# EAGLE design MCP23017_I_v1_0 (EAGLE 9.6.2)
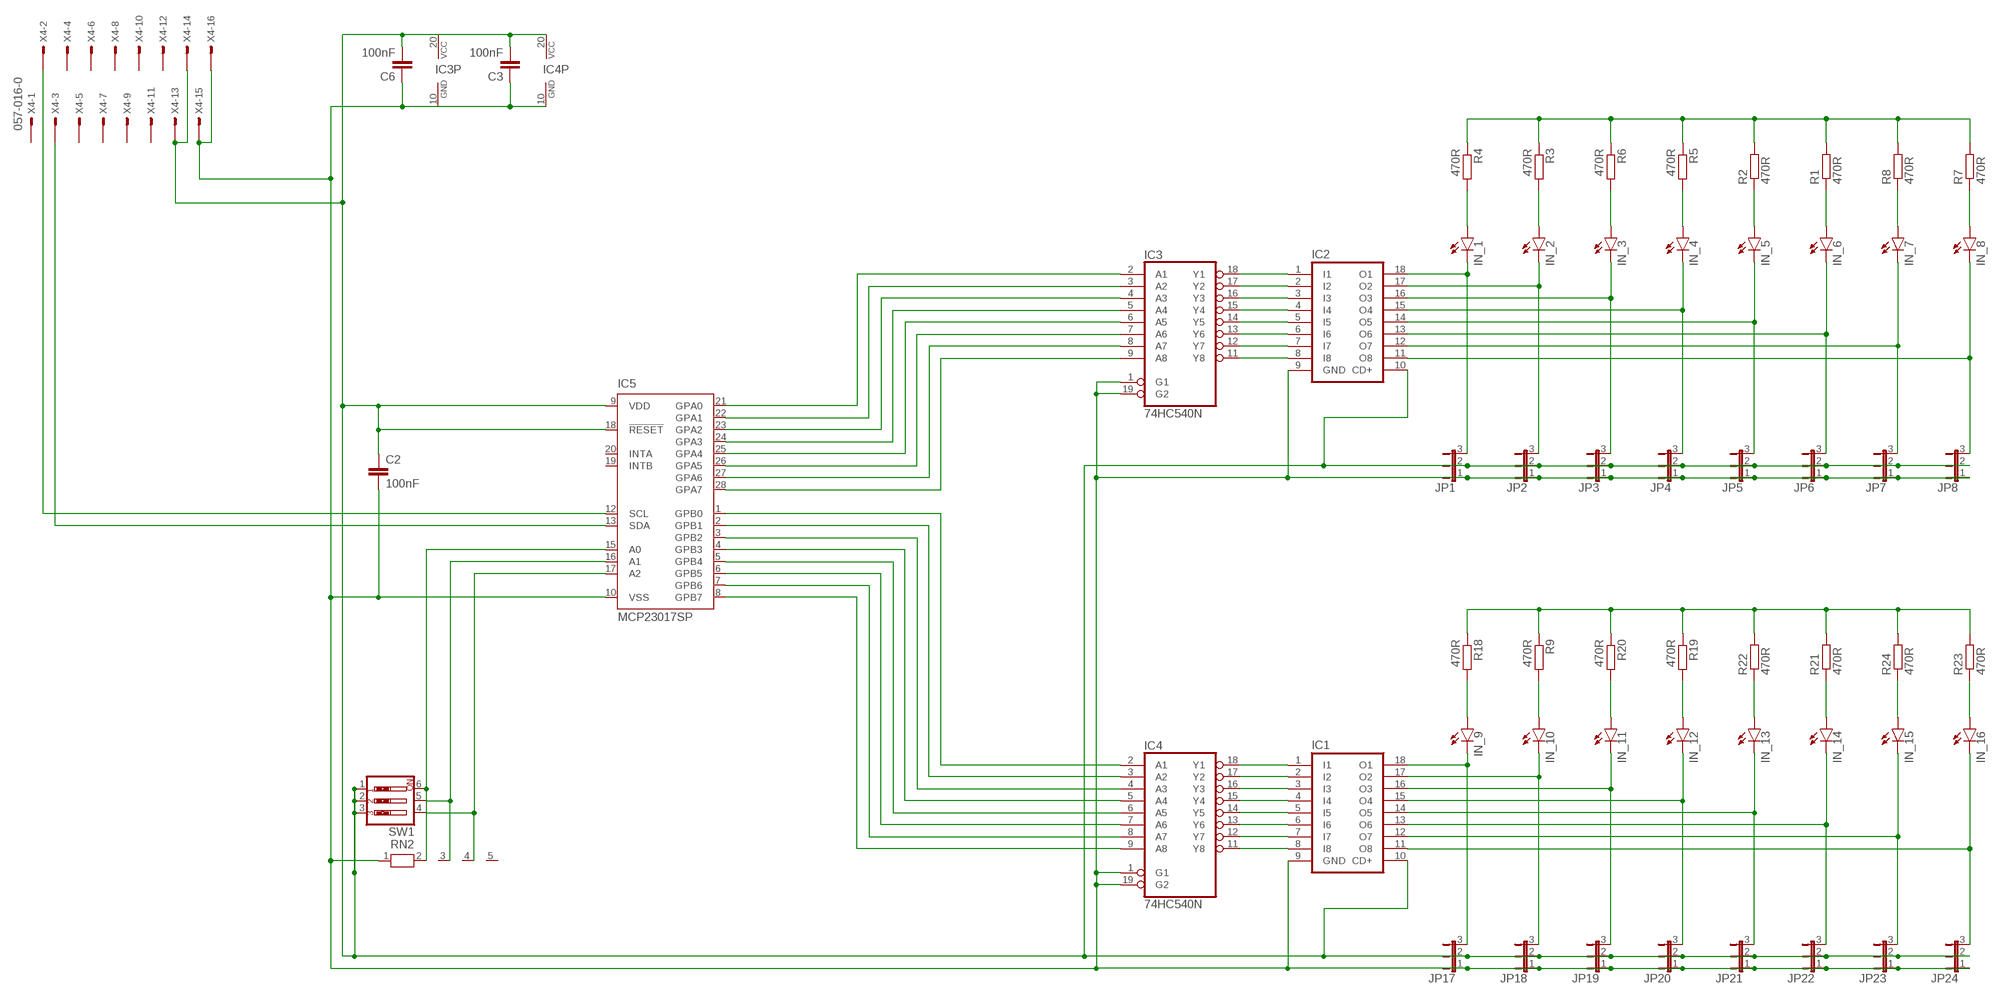
[diagram p0: schematic, sheet 1]

## Parts
C2  100nF  C-EU025-024X044  [C025-024X044]
C3  100nF  C-EU025-024X044  [C025-024X044]
C6  100nF  C-EU025-024X044  [C025-024X044]
IC1  ULN2803A  [DIL18]
IC2  ULN2803A  [DIL18]
IC3  74HC540N  [DIL20]
IC4  74HC540N  [DIL20]
IC5  MCP23017SP  [DIL28-3]
IN_1  LED3MM  [LED3MM]
IN_2  LED3MM  [LED3MM]
IN_3  LED3MM  [LED3MM]
IN_4  LED3MM  [LED3MM]
IN_5  LED3MM  [LED3MM]
IN_6  LED3MM  [LED3MM]
IN_7  LED3MM  [LED3MM]
IN_8  LED3MM  [LED3MM]
IN_9  LED3MM  [LED3MM]
IN_10  LED3MM  [LED3MM]
IN_11  LED3MM  [LED3MM]
IN_12  LED3MM  [LED3MM]
IN_13  LED3MM  [LED3MM]
IN_14  LED3MM  [LED3MM]
IN_15  LED3MM  [LED3MM]
IN_16  LED3MM  [LED3MM]
JP1  JP2E  [JP2]
JP2  JP2E  [JP2]
JP3  JP2E  [JP2]
JP4  JP2E  [JP2]
JP5  JP2E  [JP2]
JP6  JP2E  [JP2]
JP7  JP2E  [JP2]
JP8  JP2E  [JP2]
JP17  JP2E  [JP2]
JP18  JP2E  [JP2]
JP19  JP2E  [JP2]
JP20  JP2E  [JP2]
JP21  JP2E  [JP2]
JP22  JP2E  [JP2]
JP23  JP2E  [JP2]
JP24  JP2E  [JP2]
R1  470R  R-EU_0309/10  [0309/10]
R2  470R  R-EU_0309/10  [0309/10]
R3  470R  R-EU_0309/10  [0309/10]
R4  470R  R-EU_0309/10  [0309/10]
R5  470R  R-EU_0309/10  [0309/10]
R6  470R  R-EU_0309/10  [0309/10]
R7  470R  R-EU_0309/10  [0309/10]
R8  470R  R-EU_0309/10  [0309/10]
R9  470R  R-EU_0309/10  [0309/10]
R18  470R  R-EU_0309/10  [0309/10]
R19  470R  R-EU_0309/10  [0309/10]
R20  470R  R-EU_0309/10  [0309/10]
R21  470R  R-EU_0309/10  [0309/10]
R22  470R  R-EU_0309/10  [0309/10]
R23  470R  R-EU_0309/10  [0309/10]
R24  470R  R-EU_0309/10  [0309/10]
RN2  RN04  [RN-5]
SW1  SW_DIP-3  [EDG-03]
X4  057-016-0  [057-016-0]

## Nets
GND1: C2.2 C3.1 C6.1 IC1.9(GND) IC2.9(GND) IC3.1(G1) IC3.10(GND) IC3.19(G2) IC4.1(G1) IC4.10(GND) IC4.19(G2) IC5.10(VSS) JP1.1 JP2.1 JP3.1 JP4.1 JP5.1 JP6.1 JP7.1 JP8.1 JP17.1 JP18.1 JP19.1 JP20.1 JP21.1 JP22.1 JP23.1 JP24.1 RN2.1 X4.15 X4.16
N$1: IC2.18(O1) IN_1.K(C) JP1.3
N$2: IC2.17(O2) IN_2.K(C) JP2.3
N$3: IC2.16(O3) IN_3.K(C) JP3.3
N$4: IC2.15(O4) IN_4.K(C) JP4.3
N$5: IC2.14(O5) IN_5.K(C) JP5.3
N$6: IC5.17(A2) RN2.4 SW1.4
N$7: IC2.13(O6) IN_6.K(C) JP6.3
N$8: IC2.12(O7) IN_7.K(C) JP7.3
N$9: IC2.11(O8) IN_8.K(C) JP8.3
N$10: IN_8.A R7.1
N$11: IN_7.A R8.1
N$12: IC2.8(I8) IC3.11(Y8)
N$13: IN_6.A R1.1
N$14: IC2.7(I7) IC3.12(Y7)
N$15: IC2.6(I6) IC3.13(Y6)
N$16: IC2.5(I5) IC3.14(Y5)
N$17: IC2.4(I4) IC3.15(Y4)
N$18: IC2.3(I3) IC3.16(Y3)
N$19: IC2.2(I2) IC3.17(Y2)
N$20: IC2.1(I1) IC3.18(Y1)
N$21: IC3.2(A1) IC5.21(GPA0)
N$22: IC3.3(A2) IC5.22(GPA1)
N$23: IC3.4(A3) IC5.23(GPA2)
N$24: IC3.5(A4) IC5.24(GPA3)
N$25: IC3.6(A5) IC5.25(GPA4)
N$26: IC3.7(A6) IC5.26(GPA5)
N$27: IC3.8(A7) IC5.27(GPA6)
N$28: IC3.9(A8) IC5.28(GPA7)
N$29: IN_5.A R2.1
N$30: IN_4.A R5.2
N$31: IN_3.A R6.2
N$32: IN_2.A R3.2
N$33: IN_1.A R4.2
N$34: IC1.8(I8) IC4.11(Y8)
N$35: IC5.16(A1) RN2.3 SW1.5
N$36: IC1.18(O1) IN_9.K(C) JP17.3
N$37: IC1.17(O2) IN_10.K(C) JP18.3
N$38: IC1.16(O3) IN_11.K(C) JP19.3
N$39: IC1.7(I7) IC4.12(Y7)
N$40: IC1.6(I6) IC4.13(Y6)
N$41: IC1.15(O4) IN_12.K(C) JP20.3
N$42: IC1.14(O5) IN_13.K(C) JP21.3
N$43: IC1.13(O6) IN_14.K(C) JP22.3
N$44: IC1.5(I5) IC4.14(Y5)
N$45: IC1.4(I4) IC4.15(Y4)
N$46: IC1.3(I3) IC4.16(Y3)
N$47: IC1.2(I2) IC4.17(Y2)
N$48: IC1.1(I1) IC4.18(Y1)
N$49: IC4.2(A1) IC5.1(GPB0)
N$50: IC4.3(A2) IC5.2(GPB1)
N$51: IC4.4(A3) IC5.3(GPB2)
N$52: IC4.5(A4) IC5.4(GPB3)
N$53: IC1.12(O7) IN_15.K(C) JP23.3
N$54: IC1.11(O8) IN_16.K(C) JP24.3
N$55: IC4.6(A5) IC5.5(GPB4)
N$56: IC4.7(A6) IC5.6(GPB5)
N$57: IC4.8(A7) IC5.7(GPB6)
N$58: IC4.9(A8) IC5.8(GPB7)
N$59: IN_16.A R23.1
N$60: IN_15.A R24.1
N$61: IN_14.A R21.1
N$62: IN_13.A R22.1
N$63: IN_12.A R19.2
N$64: IN_11.A R20.2
N$65: IN_10.A R9.2
N$66: IN_9.A R18.2
N$82: IC5.12(SCL) X4.2
N$84: IC5.13(SDA) X4.3
N$85: IC5.15(A0) RN2.2 SW1.6
VCC5.2: C2.1 C3.2 C6.2 IC1.10(CD+) IC2.10(CD+) IC3.20(VCC) IC4.20(VCC) IC5.9(VDD) IC5.18(!RESET) JP1.2 JP2.2 JP3.2 JP4.2 JP5.2 JP6.2 JP7.2 JP8.2 JP17.2 JP18.2 JP19.2 JP20.2 JP21.2 JP22.2 JP23.2 JP24.2 R1.2 R2.2 R3.1 R4.1 R5.1 R6.1 R7.2 R8.2 R9.1 R18.1 R19.1 R20.1 R21.2 R22.2 R23.2 R24.2 SW1.1 SW1.2 SW1.3 X4.13 X4.14
Unconnected: IC5.19(INTB) IC5.20(INTA) RN2.5 X4.1 X4.4 X4.5 X4.6 X4.7 X4.8 X4.9 X4.10 X4.11 X4.12

## Library data of the parts
C2 C3 C6 = resistor:C-EU: CAPACITOR, European symbol
IC1 IC2 = uln-udn:ULN2803A: DRIVER ARRAY
IC3 IC4 = 74xx-eu:74*540: Inverting Octal BUFFER and LINE DRIVER, 3-state
IC5 = microchip-6:MCP23017: http://ww1.microchip.com/downloads/en/DeviceDoc/21952a.pdf Source: http://ww1.microchip.com/downloads/en/DeviceDoc/21952a.pdf
IN_1-IN_16 = led:LED: LED OSRAM: - CHIPLED LG R971, LG N971, LY N971, LG Q971, LY Q971, LO R971, LY R971 LH N974, LH R974 LS Q976, LO Q976, LY Q976 LO Q996 - Hyper CHIPLED LW Q18S LB Q993, LB Q99A, LB R99A - SideLED LS A670, LO A670, LY A670, LG A670, LP A670 LB A673, LV A673, LT A673, LW A673 LH A674 LY A675 LS A676, LA A676, LO A676, LY A676, LW A676 LS A679, LY A679, LG A679 - Hyper Micro SIDELED® LS Y876, LA Y876, LO Y876, LY Y876 LT Y87S - SmartLED LW L88C, LW L88S LB L89C, LB L89S, LG L890 LS L89K, LO L89K, LY L89K LS L896, LA L896, LO L896, LY L896 - TOPLED LS T670, LO T670, LY T670, LG T670, LP T670 LSG T670, LSP T670, LSY T670, LOP T670, LYG T670 LG T671, LOG T671, LSG T671 LB T673, LV T673, LT T673, LW T673 LH T674 LS T676, LA T676, LO T676, LY T676, LB T676, LH T676, LSB T676, LW T676 LB T67C, LV T67C, LT T67C, LS T67K, LO T67K, LY T67K, LW E67C LS E67B, LA E67B, LO E67B, LY E67B, LB E67C, LV E67C, LT E67C LW T67C LS T679, LY T679, LG T679 LS T770, LO T770, LY T770, LG T770, LP T770 LB T773, LV T773, LT T773, LW T773 LH T774 LS E675, LA E675, LY E675, LS T675 LS T776, LA T776, LO T776, LY T776, LB T776 LHGB T686 LT T68C, LB T68C - Hyper Mini TOPLED® LB M676 - Mini TOPLED Santana® LG M470 LS M47K, LO M47K, LY M47K Source: http://www.osram.convergy.de LUXEON: - LUMILED® LXK2-PW12-R00, LXK2-PW12-S00, LXK2-PW14-U00, LXK2-PW14-V00 LXK2-PM12-R00, LXK2-PM12-S00, LXK2-PM14-U00 LXK2-PE12-Q00, LXK2-PE12-R00, LXK2-PE12-S00, LXK2-PE14-T00, LXK2-PE14-U00 LXK2-PB12-K00, LXK2-PB12-L00, LXK2-PB12-M00, LXK2-PB14-N00, LXK2-PB14-P00, LXK2-PB14-Q00 LXK2-PR12-L00, LXK2-PR12-M00, LXK2-PR14-Q00, LXK2-PR14-R00 LXK2-PD12-Q00, LXK2-PD12-R00, LXK2-PD12-S00 LXK2-PH12-R00, LXK2-PH12-S00 LXK2-PL12-P00, LXK2-PL12-Q00, LXK2-PL12-R00 Source: www.luxeon.com KINGBRIGHT: KA-3528ASYC Source: www.kingbright.com
JP1-JP8 JP17-JP24 = jumper:JP2E: JUMPER
R1-R9 R18-R24 = resistor:R-EU_: RESISTOR, European symbol
RN2 = resistor-net:RN04: RESISTOR NETWORK; OC_FARNELL: unknown; OC_NEWARK: unknown
SW1 = special:SW_DIP-3: DIP SWITCH
X4 = con-panduit:057-016-: CONNECTOR 10-pin series 057 contact pc board low profile headers; OC_FARNELL: unknown; OC_NEWARK: unknown

## Board
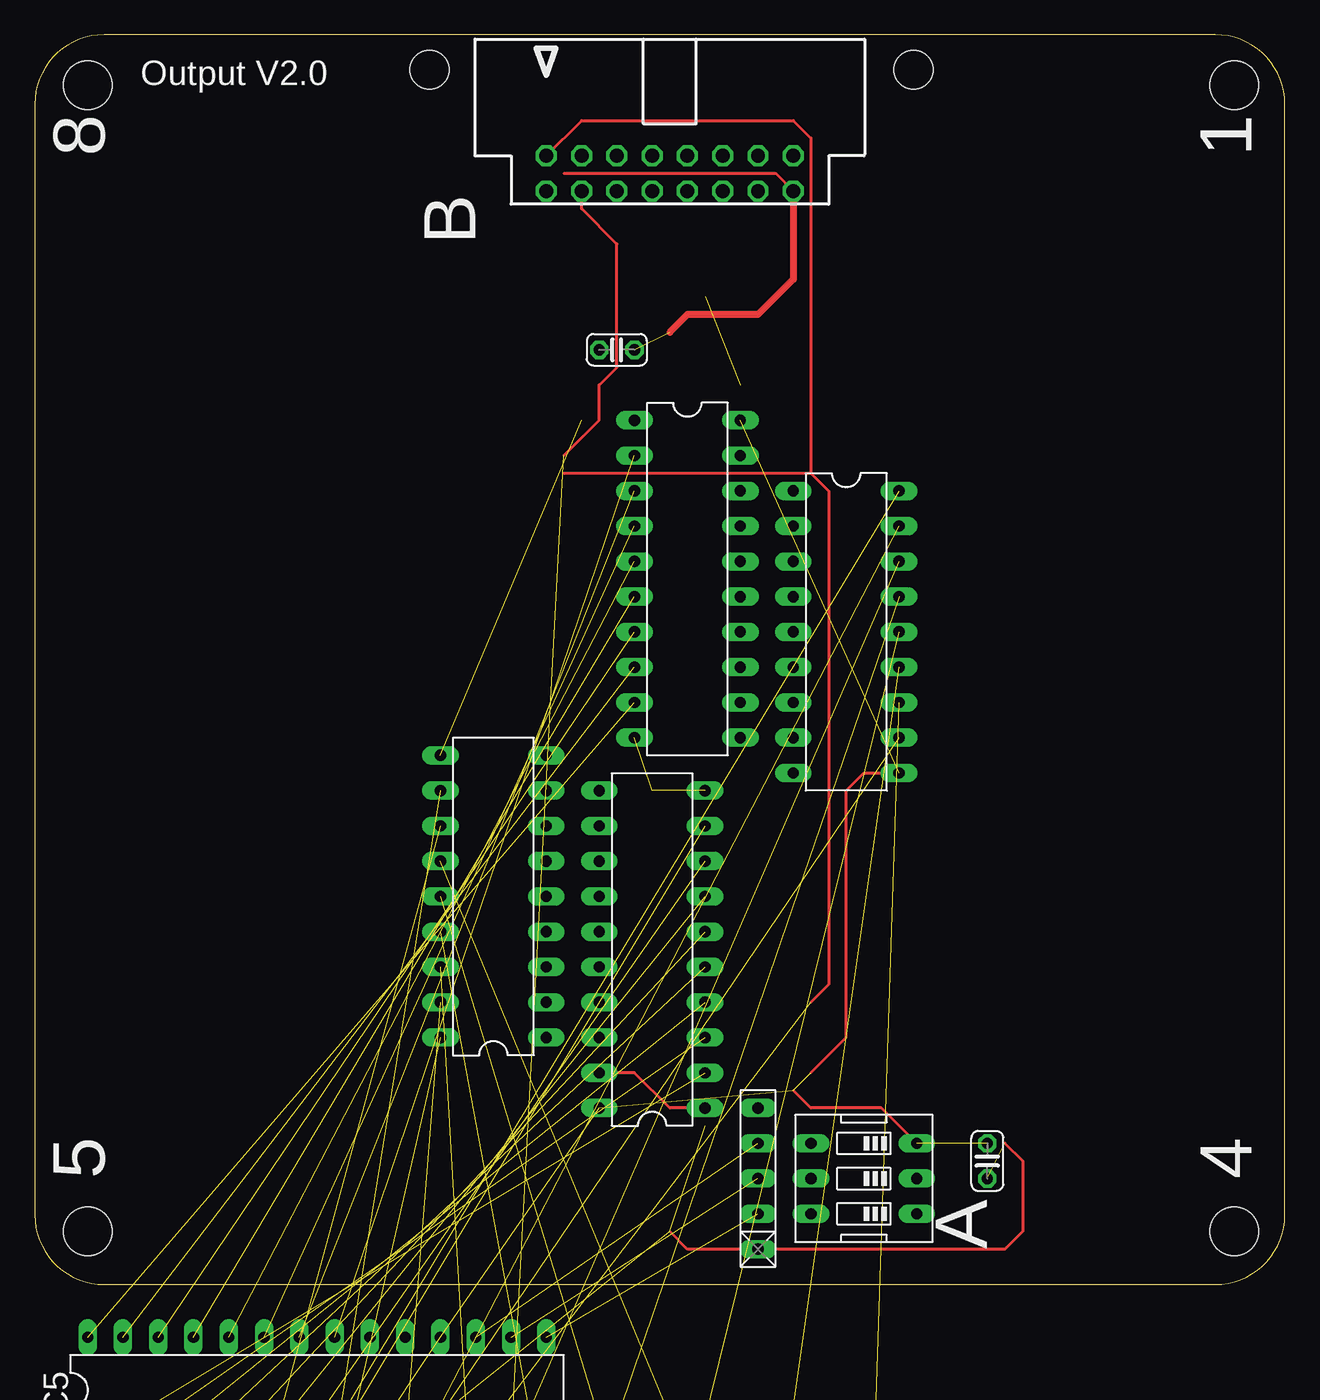
[diagram p1: board, top side]
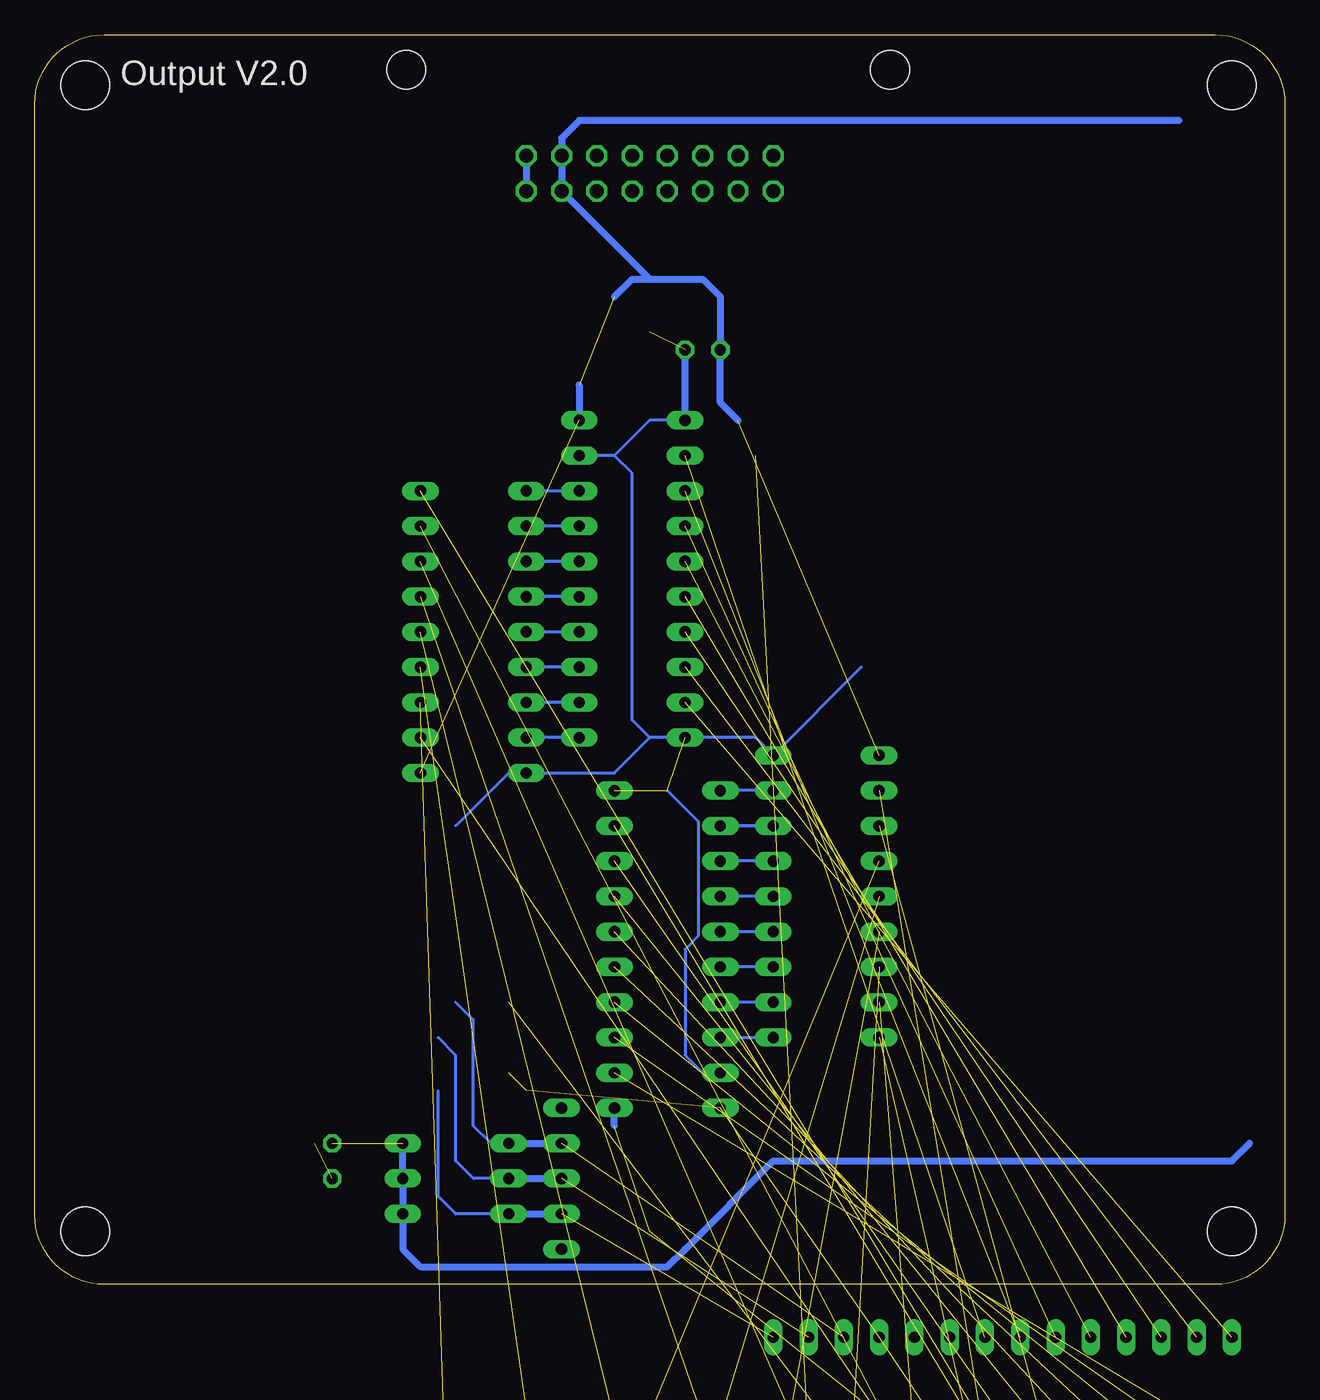
[diagram p2: board, bottom side, seen from below]

Size 90 x 90 mm. Coordinates in mm from the lower left corner, seen from the top.
Outline: 0,85 0,5 arc90 5,0 85,0 arc90 90,5 90,85 arc90 85,90 5,90 arc90 0,85
Copper layers (1*16): Top 0.035mm / dielectric 1.5mm / Bottom 0.035mm
Design rules "default": minimum track width 6mil, minimum drill 0.35mm, track to track 6mil, track to pad 6mil, pad to pad 6mil, via to via 6mil, smd to smd 6mil, copper to edge 40mil, drill to drill 6mil, minimum pad ring 10mil, minimum via ring 8mil, stop-mask expansion 4mil, vias tented up to drill 0mil, thermal gap 10mil
Holes 3.5 mm at 86.36,86.36 3.81,86.36 3.81,3.81 86.36,3.81

### Footprints (pad centres in the part's own frame; a part is rotated, then mirrored left to right if it is on the bottom)
C025-024X044 = drill 0.813 octagon: 1 -1.27,0; 2 1.27,0
DIL18 = drill 0.813 long: 1 -10.16,-3.81; 2 -7.62,-3.81; 3 -5.08,-3.81; 4 -2.54,-3.81; 5 0,-3.81; 6 2.54,-3.81; 7 5.08,-3.81; 8 7.62,-3.81; 9 10.16,-3.81; 10 10.16,3.81; 11 7.62,3.81; 12 5.08,3.81; 13 2.54,3.81; 14 0,3.81; 15 -2.54,3.81; 16 -5.08,3.81; 17 -7.62,3.81; 18 -10.16,3.81
DIL20 = drill 0.813 long: 1 -11.43,-3.81; 2 -8.89,-3.81; 3 -6.35,-3.81; 4 -3.81,-3.81; 5 -1.27,-3.81; 6 1.27,-3.81; 7 3.81,-3.81; 8 6.35,-3.81; 9 8.89,-3.81; 10 11.43,-3.81; 11 11.43,3.81; 12 8.89,3.81; 13 6.35,3.81; 14 3.81,3.81; 15 1.27,3.81; 16 -1.27,3.81; 17 -3.81,3.81; 18 -6.35,3.81; 19 -8.89,3.81; 20 -11.43,3.81
DIL28-3 = drill 0.813 long: 1 -16.51,-3.81; 2 -13.97,-3.81; 3 -11.43,-3.81; 4 -8.89,-3.81; 5 -6.35,-3.81; 6 -3.81,-3.81; 7 -1.27,-3.81; 8 1.27,-3.81; 9 3.81,-3.81; 10 6.35,-3.81; 11 8.89,-3.81; 12 11.43,-3.81; 13 13.97,-3.81; 14 16.51,-3.81; 15 16.51,3.81; 16 13.97,3.81; 17 11.43,3.81; 18 8.89,3.81; 19 6.35,3.81; 20 3.81,3.81; 21 1.27,3.81; 22 -1.27,3.81; 23 -3.81,3.81; 24 -6.35,3.81; 25 -8.89,3.81; 26 -11.43,3.81; 27 -13.97,3.81; 28 -16.51,3.81
LED3MM = drill 0.813 octagon: A -1.27,0; K 1.27,0
JP2 = drill 0.914 long: 1 -2.54,0; 2 0,0; 3 2.54,0
0309/10 = drill 0.813 octagon: 1 -5.08,0; 2 5.08,0
RN-5 = drill 0.813 long: 1 -5.08,0; 2 -2.54,0; 3 0,0; 4 2.54,0; 5 5.08,0
EDG-03 = drill 0.813 long: 1 -2.54,-3.81; 2 0,-3.81; 3 2.54,-3.81; 4 2.54,3.81; 5 0,3.81; 6 -2.54,3.81
057-016-0 = drill 1 octagon: 1 -8.89,-5.08; 2 -8.89,-2.54; 3 -6.35,-5.08; 4 -6.35,-2.54; 5 -3.81,-5.08; 6 -3.81,-2.54; 7 -1.27,-5.08; 8 -1.27,-2.54; 9 1.27,-5.08; 10 1.27,-2.54; 11 3.81,-5.08; 12 3.81,-2.54; 13 6.35,-5.08; 14 6.35,-2.54; 15 8.89,-5.08; 16 8.89,-2.54 | hole 2.8: -17.29,3.66; 17.54,3.66

### Placement (x,y rotation side)
C2  68.58,8.89 270 top
C3  2.54,-27.94 0 top  (outside the outline)
C6  41.91,67.31 180 top
IC1  33.02,27.94 90 top
IC2  58.42,46.99 270 top
IC3  46.99,50.8 270 top
IC4  44.45,24.13 90 top
IC5  20.32,-7.62 0 top  (outside the outline)
IN_1  33.02,-106.68 0 top  (outside the outline)
IN_2  41.91,-106.68 0 top  (outside the outline)
IN_3  50.8,-106.68 0 top  (outside the outline)
IN_4  2.54,-111.76 0 top  (outside the outline)
IN_5  11.43,-111.76 0 top  (outside the outline)
IN_6  20.32,-111.76 0 top  (outside the outline)
IN_7  29.21,-111.76 0 top  (outside the outline)
IN_8  38.1,-111.76 0 top  (outside the outline)
IN_9  46.99,-111.76 0 top  (outside the outline)
IN_10  15.24,-100.33 0 top  (outside the outline)
IN_11  22.86,-106.68 0 top  (outside the outline)
IN_12  25.4,-100.33 0 top  (outside the outline)
IN_13  35.56,-100.33 0 top  (outside the outline)
IN_14  45.72,-100.33 0 top  (outside the outline)
IN_15  2.54,-106.68 0 top  (outside the outline)
IN_16  12.7,-106.68 0 top  (outside the outline)
JP1  3.81,-35.56 0 top  (outside the outline)
JP2  12.7,-35.56 0 top  (outside the outline)
JP3  21.59,-35.56 0 top  (outside the outline)
JP4  30.48,-35.56 0 top  (outside the outline)
JP5  39.37,-35.56 0 top  (outside the outline)
JP6  48.26,-35.56 0 top  (outside the outline)
JP7  57.15,-35.56 0 top  (outside the outline)
JP8  3.81,-43.18 0 top  (outside the outline)
JP17  12.7,-43.18 0 top  (outside the outline)
JP18  21.59,-43.18 0 top  (outside the outline)
JP19  30.48,-43.18 0 top  (outside the outline)
JP20  39.37,-43.18 0 top  (outside the outline)
JP21  48.26,-43.18 0 top  (outside the outline)
JP22  57.15,-43.18 0 top  (outside the outline)
JP23  3.81,-50.8 0 top  (outside the outline)
JP24  12.7,-50.8 0 top  (outside the outline)
R1  22.86,-50.8 0 top  (outside the outline)
R2  35.56,-50.8 0 top  (outside the outline)
R3  48.26,-50.8 0 top  (outside the outline)
R4  6.35,-58.42 0 top  (outside the outline)
R5  19.05,-58.42 0 top  (outside the outline)
R6  31.75,-58.42 0 top  (outside the outline)
R7  44.45,-58.42 0 top  (outside the outline)
R8  6.35,-64.77 0 top  (outside the outline)
R9  19.05,-64.77 0 top  (outside the outline)
R18  31.75,-77.47 0 top  (outside the outline)
R19  44.45,-77.47 0 top  (outside the outline)
R20  6.35,-83.82 0 top  (outside the outline)
R21  19.05,-83.82 0 top  (outside the outline)
R22  31.75,-83.82 0 top  (outside the outline)
R23  44.45,-83.82 0 top  (outside the outline)
R24  6.35,-90.17 0 top  (outside the outline)
RN2  52.07,7.62 90 top
SW1  59.69,7.62 90 top
X4  45.72,83.82 0 top

### Tracks (layer width: path | path; a pad name or v marks a point on that pad's centre or on a via)
GND1  (23 unrouted)
  Top 0.2: 69.85,10.16 71.12,8.89 71.12,3.81 69.85,2.54 RN2.1 46.99,2.54 45.72,3.81 | IC4.1 45.72,12.7 43.18,15.24 IC4.19 | 38.1,80.01 53.34,80.01 X4.15
  Top 0.508: X4.15 54.61,72.39 52.07,69.85 46.99,69.85 45.72,68.58
  Bottom 0.2: 30.48,44.45 IC1.9 38.1,39.37 IC3.10 45.72,39.37 | 45.72,39.37 48.26,36.83 IC2.9 55.88,36.83 59.69,33.02 | 45.72,39.37 46.99,40.64 46.99,58.42 48.26,59.69 | 48.26,59.69 IC3.19 | IC3.1 45.72,62.23 48.26,59.69 | 44.45,35.56 42.21,33.32 42.21,25.1 43.18,24.13 43.18,16.51 41.91,15.24 IC4.19
  Bottom 0.508: 48.26,11.43 IC4.1 | X4.16 X4.15 | IC3.1 C6.1
N$1  (2 unrouted)
N$2  (2 unrouted)
N$3  (2 unrouted)
N$4  (2 unrouted)
N$5  (2 unrouted)
N$6  (1 unrouted)
  Bottom 0.2: SW1.4 57.15,10.16 58.42,11.43 58.42,19.05 59.69,20.32
  Bottom 0.508: SW1.4 RN2.4
N$7  (2 unrouted)
N$8  (2 unrouted)
N$9  (2 unrouted)
N$10  (1 unrouted)
N$11  (1 unrouted)
N$12
  Bottom 0.2: IC3.11 IC2.8
N$13  (1 unrouted)
N$14
  Bottom 0.2: IC3.12 IC2.7
N$15
  Bottom 0.2: IC3.13 IC2.6
N$16
  Bottom 0.2: IC3.14 IC2.5
N$17
  Bottom 0.2: IC3.15 IC2.4
N$18
  Bottom 0.2: IC3.16 IC2.3
N$19
  Bottom 0.2: IC3.17 IC2.2
N$20
  Bottom 0.2: IC3.18 IC2.1
N$21  (1 unrouted)
N$22  (1 unrouted)
N$23  (1 unrouted)
N$24  (1 unrouted)
N$25  (1 unrouted)
N$26  (1 unrouted)
N$27  (1 unrouted)
N$28  (1 unrouted)
N$29  (1 unrouted)
N$30  (1 unrouted)
N$31  (1 unrouted)
N$32  (1 unrouted)
N$33  (1 unrouted)
N$34
  Bottom 0.2: IC1.8 IC4.11
N$35  (1 unrouted)
  Bottom 0.2: SW1.5 58.42,7.62 59.69,8.89 59.69,16.51 60.96,17.78
  Bottom 0.508: SW1.5 RN2.3
N$36  (2 unrouted)
N$37  (2 unrouted)
N$38  (2 unrouted)
N$39
  Bottom 0.2: IC1.7 IC4.12
N$40
  Bottom 0.2: IC1.6 IC4.13
N$41  (2 unrouted)
N$42  (2 unrouted)
N$43  (2 unrouted)
N$44
  Bottom 0.2: IC1.5 IC4.14
N$45
  Bottom 0.2: IC1.4 IC4.15
N$46
  Bottom 0.2: IC1.3 IC4.16
N$47
  Bottom 0.2: IC1.2 IC4.17
N$48
  Bottom 0.2: IC4.18 IC1.1
N$49  (1 unrouted)
N$50  (1 unrouted)
N$51  (1 unrouted)
N$52  (1 unrouted)
N$53  (2 unrouted)
N$54  (2 unrouted)
N$55  (1 unrouted)
N$56  (1 unrouted)
N$57  (1 unrouted)
N$58  (1 unrouted)
N$59  (1 unrouted)
N$60  (1 unrouted)
N$61  (1 unrouted)
N$62  (1 unrouted)
N$63  (1 unrouted)
N$64  (1 unrouted)
N$65  (1 unrouted)
N$66  (1 unrouted)
N$82  (1 unrouted)
  Top 0.2: 55.88,58.42 57.15,57.15 57.15,21.59 55.88,20.32 | 38.1,58.42 55.88,58.42 | X4.2 39.37,83.82 54.61,83.82 55.88,82.55 55.88,58.42
N$84  (1 unrouted)
  Top 0.2: 38.1,59.69 40.64,62.23 40.64,64.77 41.91,66.04 41.91,74.93 39.37,77.47 X4.3
N$85  (1 unrouted)
  Bottom 0.2: SW1.6 59.69,5.08 60.96,6.35 60.96,13.97
  Bottom 0.508: SW1.6 RN2.2
VCC5.2  (41 unrouted)
  Top 0.2: 55.88,15.24 58.42,17.78 58.42,35.56 59.69,36.83 IC2.10 | SW1.3 60.96,12.7 55.88,12.7 54.61,13.97
  Bottom 0.508: 7.62,83.82 50.8,83.82 52.07,82.55 X4.14 X4.13 45.72,72.39 | 45.72,72.39 41.91,72.39 40.64,71.12 C6.2 40.64,63.5 39.37,62.23 | 50.8,64.77 IC3.20 | 48.26,71.12 46.99,72.39 45.72,72.39 | SW1.3 SW1.2 SW1.1 63.5,2.54 62.23,1.27 44.45,1.27 43.18,2.54 36.83,8.89 3.81,8.89 2.54,10.16

### Text on the board
tNames: Output V2.0 | 8 | 1 | B | 5 | 4 | A
bNames: Output V2.0